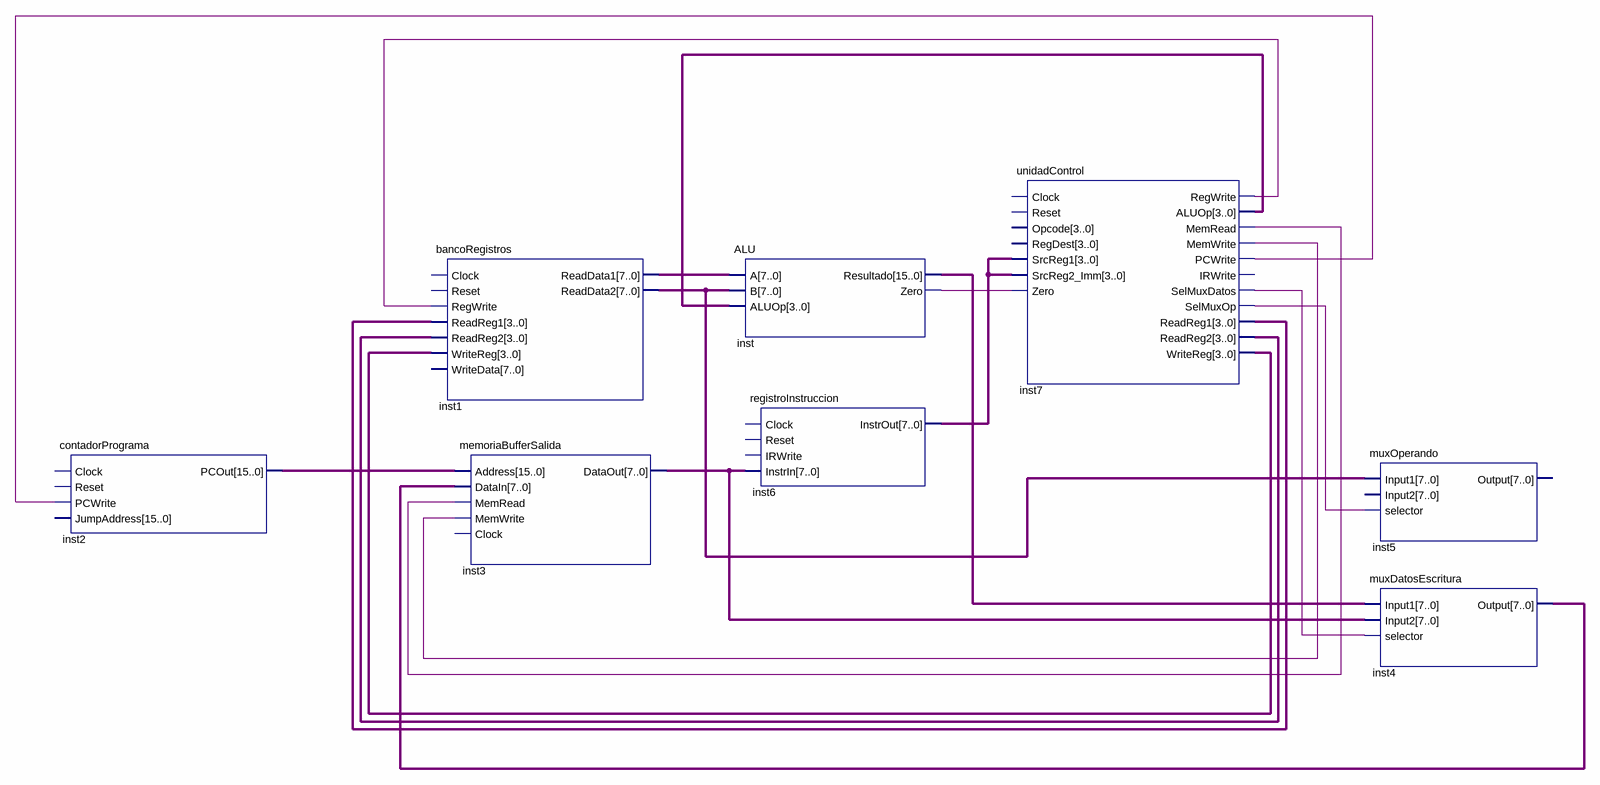
[diagram p0: schematic sheet]
// Quartus schematic uControlador8bits.bdf as structural Verilog: 8 symbols, 0 pins
module uControlador8bits (
);

  wire inst7_memread, inst7_memwrite, inst7_pcwrite, inst7_regwrite, inst7_selmuxdatos, inst7_selmuxop,
       inst_zero;
  wire [3:0] inst7_aluop, inst7_readreg1, inst7_readreg2, inst7_writereg;
  wire [7:0] inst1_readdata1, inst1_readdata2, inst3_dataout, inst4_output, inst6_instrout;
  wire [15:0] inst2_pcout, inst_resultado;

  contadorPrograma inst2 (.PCWrite(inst7_pcwrite), .PCOut(inst2_pcout));  // open: Clock, Reset, JumpAddress
  bancoRegistros inst1 (
    .RegWrite(inst7_regwrite), .ReadReg1(inst7_readreg1), .ReadReg2(inst7_readreg2),
    .WriteReg(inst7_writereg), .ReadData1(inst1_readdata1), .ReadData2(inst1_readdata2));  // open: Clock, Reset, WriteData
  memoriaBufferSalida inst3 (
    .Address(inst2_pcout), .DataIn(inst4_output), .MemRead(inst7_memread), .MemWrite(inst7_memwrite),
    .DataOut(inst3_dataout));  // open: Clock
  ALU inst (
    .A(inst1_readdata1), .B(inst1_readdata2), .ALUOp(inst7_aluop), .Resultado(inst_resultado),
    .Zero(inst_zero));
  registroInstruccion inst6 (.InstrIn(inst3_dataout), .InstrOut(inst6_instrout));  // open: Clock, Reset, IRWrite
  unidadControl inst7 (
    .SrcReg1(inst6_instrout), .SrcReg2_Imm(inst6_instrout), .Zero(inst_zero), .RegWrite(inst7_regwrite),
    .ALUOp(inst7_aluop), .MemRead(inst7_memread), .MemWrite(inst7_memwrite), .PCWrite(inst7_pcwrite),
    .SelMuxDatos(inst7_selmuxdatos), .SelMuxOp(inst7_selmuxop), .ReadReg1(inst7_readreg1),
    .ReadReg2(inst7_readreg2), .WriteReg(inst7_writereg));  // open: Clock, Reset, Opcode, RegDest, IRWrite
  muxOperando inst5 (.Input1(inst1_readdata2), .selector(inst7_selmuxop));  // open: Input2, Output
  muxDatosEscritura inst4 (
    .Input1(inst_resultado), .Input2(inst3_dataout), .selector(inst7_selmuxdatos), .Output(inst4_output));
endmodule
